# Altium schematic sheet Sch_pwr_sys.SchDoc
size Letter
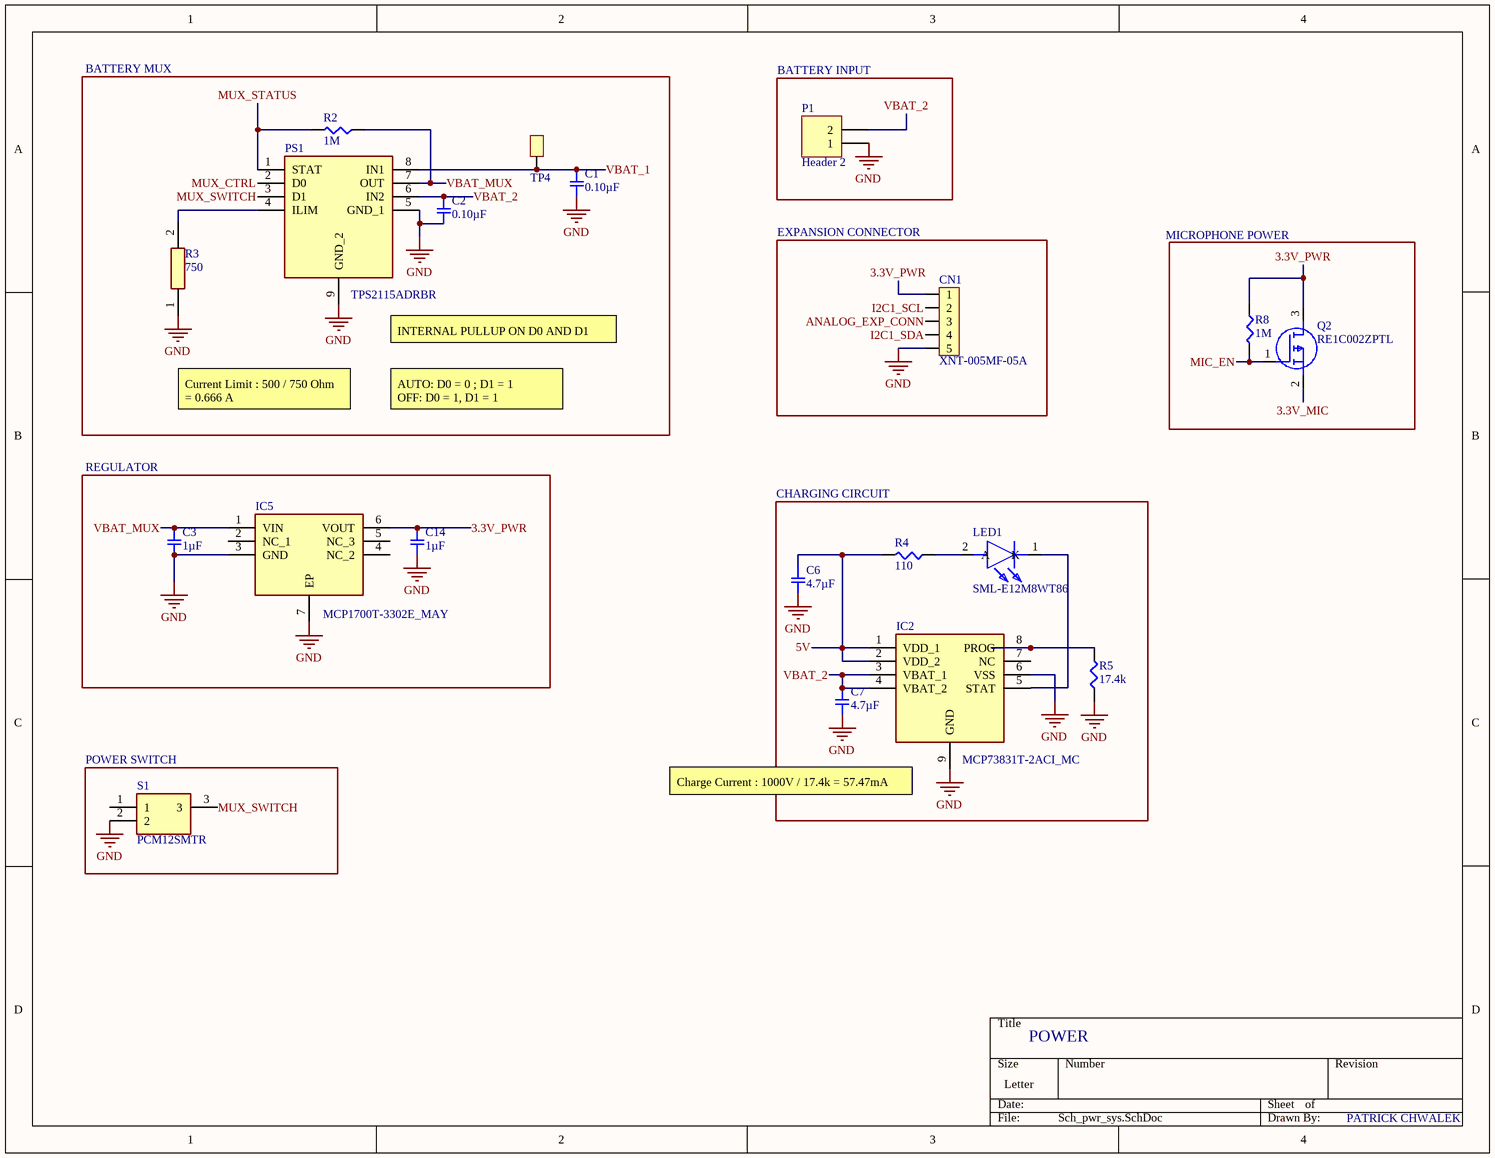
[diagram p0: Sch_pwr_sys.SchDoc]

## Parts
C1  0.10µF  [SMD-0402C]
C2  0.10µF  [SMD-0402C]
C3  1µF  [SMD-0402C]
C6  4.7µF  [SMD-0402C]
C7  4.7µF  [SMD-0402C]
C14  1µF  [SMD-0402C]
CN1  XNT-005MF-05A  [XNT-005MF-05A]
IC2  MCP73831T-2ACI_MC  [SON50P300X200X100-9N-D]
IC5  MCP1700T-3302E_MAY  [SON65P200X200X90-7N]
LED1  SML-E12M8WT86  [LEDC1608X46N]
P1  Header 2  [HDR1X2]
PS1  TPS2115ADRBR  [SON65P300X300X100-9N-D]
Q2  RE1C002ZPTL  [SOTFL50P160X85-3N]
R2  1M  [SMD-0402-RES]
R3  750  [RESC1005X40N]
R4  110  [SMD-0402-RES]
R5  17.4k  [SMD-0402-RES]
R8  1M  [SMD-0402-RES]
S1  PCM12SMTR  [PCM12SMTR_1]
TP4  TestPoint  [TestPoint_0.4mm]  (value not drawn)

## Blocks framed on the sheet
BATTERY MUX: C1 C2 PS1 R2 R3 TP4
BATTERY INPUT: P1
EXPANSION CONNECTOR: CN1
REGULATOR: C3 C14 IC5
CHARGING CIRCUIT: C6 C7 IC2 LED1 R4 R5
POWER SWITCH: S1

## Nets
GND: C1.2 C2.2 C3.2 C6.2 C7.2 C14.2 CN1.5 IC2.6(VSS) IC2.9(GND) IC5.3(GND) IC5.7(EP) P1.1 PS1.5(GND_1) PS1.9(GND_2) R3.1 R5.1 S1.2
3.3V_MIC: Q2.2(S)
3.3V_PWR: C14.1 CN1.1 IC5.6(VOUT) Q2.3(D) R8.1
5V: C6.1 IC2.1(VDD_1) IC2.2(VDD_2) R4.2
ANALOG_EXP_CONN: CN1.3
I2C1_SCL: CN1.2
I2C1_SDA: CN1.4
MIC_EN: Q2.1(G) R8.2
MUX_CTRL: PS1.2(D0)
MUX_STATUS: PS1.1(STAT) R2.2
MUX_SWITCH: PS1.3(D1) S1.3
VBAT_1: C1.1 PS1.8(IN1) TP4.1
VBAT_2: C2.1 C7.1 IC2.3(VBAT_1) IC2.4(VBAT_2) P1.2 PS1.6(IN2)
VBAT_MUX: C3.1 IC5.1(VIN) PS1.7(OUT) R2.1
NetIC2_5: IC2.5(STAT) LED1.1(K)
NetIC2_8: IC2.8(PROG) R5.2
NetLED1_2: LED1.2(A) R4.1
NetPS1_4: PS1.4(ILIM) R3.2

Not connected (* = marked no-connect by the designer): IC2 7(NC); IC5 2(NC_1) 4(NC_2) 5(NC_3); S1 1

## Notes on the sheet
- MICROPHONE POWER
- (near PS1) INTERNAL PULLUP ON D0 AND D1
- Current Limit : 500 / 750 Ohm = 0.666 A
- AUTO: D0 = 0 ; D1 = 1
  OFF: D0 = 1, D1 = 1
- (near IC2) Charge Current : 1000V / 17.4k = 57.47mA
- POWER
- PATRICK CHWALEK

## Library data of the parts
C1 C2 = GCM155R71C104KA55D: CAP CER 0.1UF 16V X7R 0402; Manufacturer: Murata Electronics North America; Factory Stock: 0; Unit Price (USD): 0.1; Minimum Quantity: 1; Tolerance: ±10%; Datasheets: http://www.murata.com/~/media/webrenewal/support/library/catalog/products/capacitor/mlcc/c03e.ashx; Image: //media.digikey.com/Renders/Murata%20Renders/ZRB-SERIES-0402.jpg; Digi-Key Part Number: 490-4759-1-ND; Part Number: GCM155R71C104KA55D; Quantity Available: 734194; @ qty: 0; Packaging: Cut Tape (CT); Series: GCM; Part Status: Active; Value: 0.10µF; Voltage: 16V; Temperature Coefficient: X7R; Operating Temperature: -55°C ~ 125°C; Features: -; Ratings: AEC-Q200; Applications: Automotive; Mounting Type: Surface Mount, MLCC; Package / Case: 0402 (1005 Metric); Size / Dimension: 0.039" L x 0.020" W (1.00mm x 0.50mm); Height - Seated (Max): -; Thickness (Max): 0.022" (0.55mm); Lead Spacing: -; Lead Style: -
C3 C14 = GCM155C71A105KE38D: CAP CER 1UF 10V X7S 0402; Manufacturer: Murata Electronics North America; Factory Stock: 0; Unit Price (USD): 0.12; Minimum Quantity: 1; Tolerance: ±10%; Datasheets: http://www.murata.com/~/media/webrenewal/support/library/catalog/products/capacitor/mlcc/c03e.ashx; Image: //media.digikey.com/Renders/Murata%20Renders/ZRB-SERIES-0402.jpg; Digi-Key Part Number: 490-13409-1-ND; Part Number: GCM155C71A105KE38D; Quantity Available: 7240; @ qty: 0; Packaging: Cut Tape (CT); Series: GCM; Part Status: Active; Value: 1µF; Voltage: 10V; Temperature Coefficient: X7S; Operating Temperature: -55°C ~ 125°C; Features: -; Ratings: AEC-Q200; Applications: Automotive; Mounting Type: Surface Mount, MLCC; Package / Case: 0402 (1005 Metric); Size / Dimension: 0.039" L x 0.020" W (1.00mm x 0.50mm); Height - Seated (Max): -; Thickness (Max): 0.022" (0.55mm); Lead Spacing: -; Lead Style: -
C6 C7 = GRM153R60G475ME15D: CAP CER 4.7UF 4V X5R 0402; Manufacturer: Murata Electronics North America; Factory Stock: 0; Unit Price (USD): 0.27; Minimum Quantity: 1; Tolerance: ±20%; Datasheets: http://psearch.en.murata.com/capacitor/product/GRM153R60G475ME15%23.pdf; Image: //media.digikey.com/Renders/Murata%20Renders/ZRB-SERIES-0402.jpg; Digi-Key Part Number: 490-13231-1-ND; Part Number: GRM153R60G475ME15D; Quantity Available: 9100; @ qty: 0; Packaging: Cut Tape (CT); Series: GRM; Part Status: Active; Value: 4.7µF; Voltage: 4V; Temperature Coefficient: X5R; Operating Temperature: -55°C ~ 85°C; Features: -; Ratings: -; Applications: General Purpose; Mounting Type: Surface Mount, MLCC; Package / Case: 0402 (1005 Metric); Size / Dimension: 0.039" L x 0.020" W (1.00mm x 0.50mm); Height - Seated (Max): -; Thickness (Max): 0.013" (0.33mm); Lead Spacing: -; Lead Style: -
IC2 = MCP73831T-2ACI_MC: Integrated Circuit; Manufacturer_Name: Microchip; Manufacturer_Part_Number: MCP73831T-2ACI/MC; Allied_Number: 70452042; Datasheet Link: http://ww1.microchip.com/downloads/en/DeviceDoc/20001984g.pdf; Height: 1mm; Mouser Part Number: 579-MCP73831T-2ACIMC; Mouser Price/Stock: https://www.mouser.com/Search/Refine.aspx?Keyword=579-MCP73831T-2ACIMC; Allied Price/Stock: https://www.alliedelec.com/microchiptechnologyinc-mcp73831t-2aci-mc/70452042/
IC5 = MCP1700T-3302E_MAY: Integrated Circuit; Manufacturer_Name: Microchip; Manufacturer_Part_Number: MCP1700T-3302E/MAY; Allied_Number: 70567878; Datasheet Link: http://ww1.microchip.com/downloads/en/DeviceDoc/20001826D.pdf; Height: 0.9mm; Mouser Part Number: 579-MCP1700T3302EMAY; Mouser Price/Stock: https://www.mouser.com/Search/Refine.aspx?Keyword=579-MCP1700T3302EMAY; Allied Price/Stock: https://www.alliedelec.com/microchip-technology-inc-mcp1700t-3302e-may/70567878/
LED1 = SML-E12M8WT86: LED; Manufacturer_Name: ROHM Semiconductor; Datasheet Link: https://www.rohm.com/datasheet/SML-E12M8W/sml-e1-e; Height: 0.46mm; Manufacturer_Part_Number: SML-E12M8WT86; Mouser Part Number: 755-SML-E12M8WT86; Mouser Price/Stock: https://www.mouser.com/Search/Refine.aspx?Keyword=755-SML-E12M8WT86; RS Part Number: 6942799; RS Price/Stock: http://uk.rs-online.com/web/p/products/6942799
P1 = Header 2: Header, 2-Pin; LatestRevisionDate: 17-Jul-2002; LatestRevisionNote: Re-released for DXP Platform.; Publisher: Altium Limited
PS1 = TPS2115ADRBR: Power Supply; Manufacturer_Name: Texas Instruments; Datasheet Link: http://www.ti.com/lit/gpn/tps2115a; Height: 1mm; Manufacturer_Part_Number: TPS2115ADRBR; Mouser Part Number: 595-TPS2115ADRBR; Mouser Price/Stock: https://www.mouser.com/Search/Refine.aspx?Keyword=595-TPS2115ADRBR
Q2 = RE1C002ZPTL: MOSFET (P-Channel); Manufacturer_Name: ROHM Semiconductor; Datasheet Link: https://componentsearchengine.com/Datasheets/1/RE1C002ZPTL.pdf; Height: 0.85mm; Manufacturer_Part_Number: RE1C002ZPTL; Mouser Part Number: 755-RE1C002ZPTL; Mouser Price/Stock: https://www.mouser.com/Search/Refine.aspx?Keyword=755-RE1C002ZPTL; RS Part Number: 1486960P; RS Price/Stock: http://uk.rs-online.com/web/p/products/1486960P
R2 R8 = ERJ-2GEJ105X: RES SMD 1M OHM 5% 1/10W 0402; Manufacturer: Panasonic Electronic Components; Factory Stock: 0; Unit Price (USD): 0.00350; @ qty: 1500; Minimum Quantity: 1; Power (Watts): 0.1W, 1/10W; Temperature Coefficient: ±200ppm/°C; Part Number: ERJ-2GEJ105X; Datasheets: http://industrial.panasonic.com/www-cgi/jvcr13pz.cgi?E+PZ+3+AOA0001+ERJ2GEJ105X+7+WW; Image: //media.digikey.com/Photos/Panasonic%20Photos/ERJ-PA2-Series.jpg; Digi-Key Part Number: P1.0MJCT-ND; Quantity Available: 1082572; Packaging: Cut Tape (CT); Series: ERJ; Part Status: Active; Value: 1M; Tolerance: ±5%; Composition: Thick Film; Features: Automotive AEC-Q200; Operating Temperature: -55°C ~ 155°C; Package / Case: 0402 (1005 Metric); Supplier Device Package: 0402; Size / Dimension: 0.039" L x 0.020" W (1.00mm x 0.50mm); Height - Seated (Max): 0.016" (0.40mm); Number of Terminations: 2; Failure Rate: -
R3 = ERJ-2RKF7500X: RES SMD 750 OHM 1% 1/10W 0402; Manufacturer_Name: Panasonic; Allied_Number: 70265602; Datasheet Link: https://industrial.panasonic.com/cdbs/www-data/pdf/RDA0000/AOA0000C86.pdf; Height: 0.4mm; Manufacturer_Part_Number: ERJ-2RKF7500X; Mouser Part Number: 667-ERJ-2RKF7500X; Allied Price/Stock: https://www.alliedelec.com/panasonic-erj-2rkf7500x/70265602/; Value: 750
R4 = ERJ-2RKF8062X: RES SMD 110 OHM 5% 1/10W 0402; Manufacturer: Panasonic Electronic Components; Factory Stock: 0; Unit Price (USD): 0.00496; @ qty: 1500; Minimum Quantity: 1; Power (Watts): 0.1W, 1/10W; Temperature Coefficient: ±100ppm/°C; Part Number: ERJ-2RKF8062X; Datasheets: http://industrial.panasonic.com/www-cgi/jvcr13pz.cgi?E+PZ+3+AOA0002+ERJ2RKF8062X+7+WW; Image: //media.digikey.com/Photos/Panasonic%20Photos/ERJ-PA2-Series.jpg; Digi-Key Part Number: P80.6KLCT-ND; Quantity Available: 91747; Packaging: Cut Tape (CT); Series: ERJ; Part Status: Active; Value: 110; Tolerance: ±5%; Composition: Thick Film; Features: Automotive AEC-Q200; Operating Temperature: -55°C ~ 155°C; Package / Case: 0402 (1005 Metric); Supplier Device Package: 0402; Size / Dimension: 0.039" L x 0.020" W (1.00mm x 0.50mm); Height - Seated (Max): 0.016" (0.40mm); Number of Terminations: 2; Failure Rate: -
R5 = ERJ-2GEJ103X: RES SMD 17.4K OHM 1% 1/10W 0402; Manufacturer: Panasonic Electronic Components; Factory Stock: 0; Unit Price (USD): 0.00350; @ qty: 1500; Minimum Quantity: 1; Power (Watts): 0.1W, 1/10W; Temperature Coefficient: ±200ppm/°C; Part Number: ERJ-2GEJ103X; Datasheets: http://industrial.panasonic.com/www-cgi/jvcr13pz.cgi?E+PZ+3+AOA0001+ERJ2GEJ103X+7+WW; Image: //media.digikey.com/Photos/Panasonic%20Photos/ERJ-PA2-Series.jpg; Digi-Key Part Number: P10KJCT-ND; Quantity Available: 2560215; Packaging: Cut Tape (CT); Series: ERJ; Part Status: Active; Value: 17.4k; Tolerance: ±1%; Composition: Thick Film; Features: Automotive AEC-Q200; Operating Temperature: -55°C ~ 155°C; Package / Case: 0402 (1005 Metric); Supplier Device Package: 0402; Size / Dimension: 0.039" L x 0.020" W (1.00mm x 0.50mm); Height - Seated (Max): 0.016" (0.40mm); Number of Terminations: 2; Failure Rate: -
S1 = PCM12SMTR: Switch; Manufacturer_Name: C & K COMPONENTS; Allied_Number: 70417448; Datasheet Link: http://www.farnell.com/datasheets/1789487.pdf; Manufacturer_Part_Number: PCM12SMTR; Mouser Part Number: 611-PCM12SMTR; Mouser Price/Stock: https://www.mouser.com/Search/Refine.aspx?Keyword=611-PCM12SMTR; RS Part Number: 7931721P; RS Price/Stock: http://uk.rs-online.com/web/p/products/7931721P; Allied Price/Stock: https://www.alliedelec.com/c-k-pcm12smtr/70417448/